# EAGLE design solar_liion (EAGLE 9.5.2)
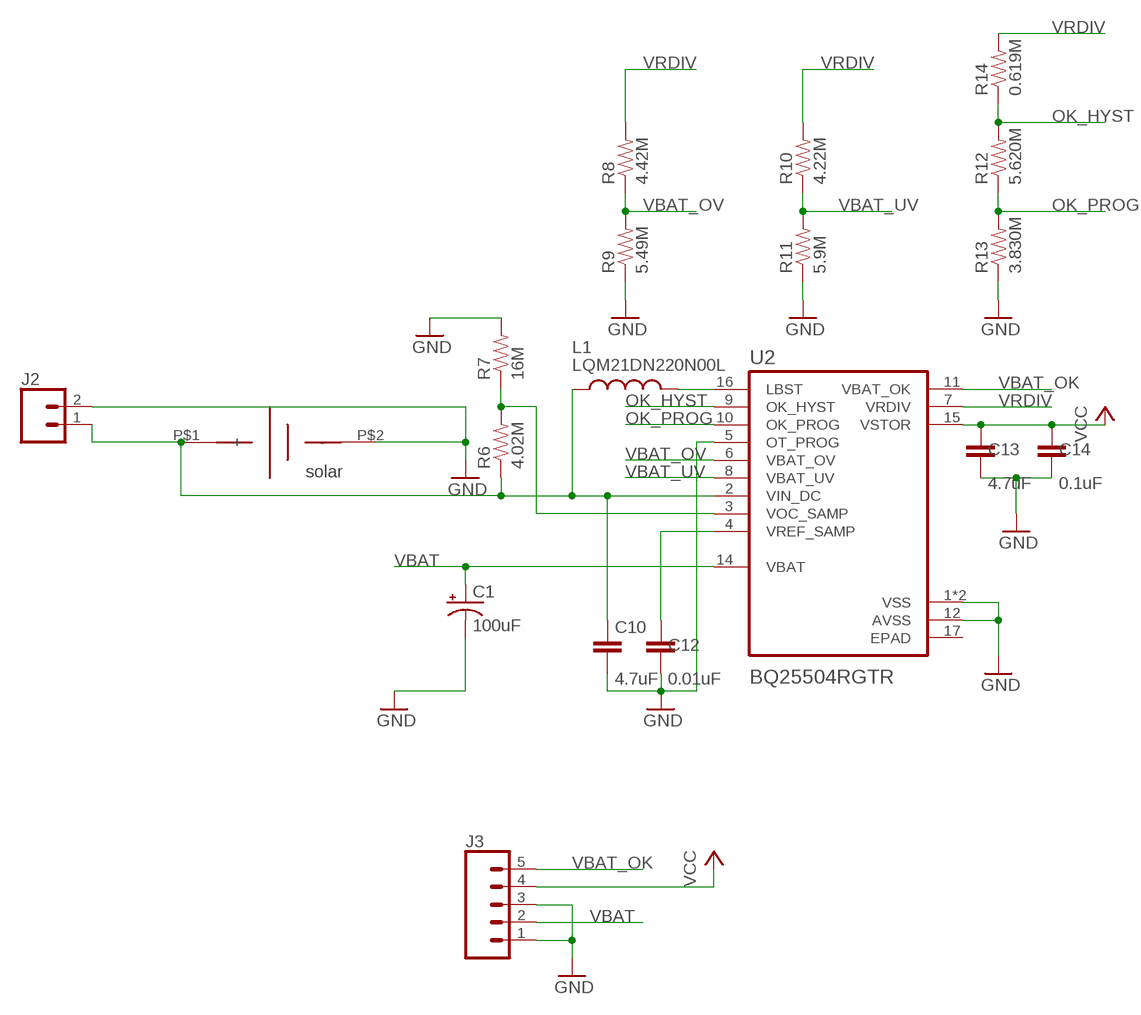
[diagram p0: schematic, sheet 1]

## Parts
C1  100uF  100UF-POLAR-EIA7343-10V-10%(TANT)  [EIA7343]
C10  4.7uF  10NF-0603-50V-10%  [0603]
C12  0.01uF  10NF-0603-50V-10%  [0603]
C13  4.7uF  10NF-0603-50V-10%  [0603]
C14  0.1uF  10NF-0603-50V-10%  [0603]
J2  CONN_02  [1X02]
J3  CONN_05  [1X05]
L1  LQM21DN220N00L  [INDC2012X145N]
R6  4.02M  470OHM-0603-1/10W-1%  [0603]
R7  16M  470OHM-0603-1/10W-1%  [0603]
R8  4.42M  470OHM-0603-1/10W-1%  [0603]
R9  5.49M  470OHM-0603-1/10W-1%  [0603]
R10  4.22M  470OHM-0603-1/10W-1%  [0603]
R11  5.9M  470OHM-0603-1/10W-1%  [0603]
R12  5.620M  470OHM-0603-1/10W-1%  [0603]
R13  3.830M  470OHM-0603-1/10W-1%  [0603]
R14  0.619M  470OHM-0603-1/10W-1%  [0603]
U2  BQ25504RGTR  [QFN50P300X300X100-17N]
U$3  KXOB25-04X3F-TR  [KXOB25-04X3F-TR]

## Nets
GND: C1.C(-) C10.2 C12.2 C13.2 C14.2 J2.2 J3.1 J3.3 R7.2 R9.1 R11.1 R13.1 U2.1(VSS) U2.5(OT_PROG) U2.12(AVSS) U2.13(VSS) U$3.P$2(-)
N$16: C10.1 J2.1 L1.1 R6.1 U2.2(VIN_DC) U$3.P$1(+)
N$17: L1.2 U2.16(LBST)
N$18: C12.1 U2.4(VREF_SAMP)
N$19: R6.2 R7.1 U2.3(VOC_SAMP)
OK_HYST: R12.2 R14.1 U2.9(OK_HYST)
OK_PROG: R12.1 R13.2 U2.10(OK_PROG)
VBAT: C1.A(+) J3.2 U2.14(VBAT)
VBAT_OK: J3.5 U2.11(VBAT_OK)
VBAT_OV: R8.1 R9.2 U2.6(VBAT_OV)
VBAT_UV: R10.1 R11.2 U2.8(VBAT_UV)
VCC: C13.1 C14.1 J3.4 U2.15(VSTOR)
VRDIV: R8.2 R10.2 R14.2 U2.7(VRDIV)

## Notes on the sheet
- solar

## Power pins joined to a net without a drawn wire
EPAD: U2.17(EPAD)

## Library data of the parts
C1 = SparkFun-Capacitors:100UF-POLAR: 100µF polarized capacitors A capacitor is a passive two-terminal electrical component used to store electrical energy temporarily in an electric field.; PROD_ID: CAP-07890
C10 C12-C14 = SparkFun-Capacitors:10NF: 0.01uF/10nF/10,000pF ceramic capacitors A capacitor is a passive two-terminal electrical component used to store electrical energy temporarily in an electric field. CAP-09321; PROD_ID: CAP-00867; VALUE: 10nF
J2 = SparkFun-Connectors:CONN_02: Multi connection point. Often used as Generic Header-pin footprint for 0.1 inch spaced/style header connections On any of the 0.1 inch spaced packages, you can populate with these: Break Away Headers - Straight <https://www.sparkfun.com/products/116> (PRT-00116) Break Away Male Headers - Right Angle <https://www.sparkfun.com/products/553> (PRT-00553) Female Headers <https://www.sparkfun.com/products/115> (PRT-00115) Break Away Headers - Machine Pin <https://www.sparkfun.com/products/117> (PRT-00117) Break Away Female Headers - Swiss Machine Pin <https://www.sparkfun.com/products/743> (PRT-00743) For SCREWTERMINALS and SPRING TERMINALS visit here: Screw Terimnals on SparkFun.com <https://www.sparkfun.com/search/results?term=Screw+Terminals> (5mm/3.5mm/2.54mm spacing) This device is also useful as a general connection point to wire up your design to another part of your project. Our various solder wires solder well into these plated through hole pads. Hook-Up Wire - Assortment (Stranded, 22 AWG) <https://www.sparkfun.com/products/11375> (PRT-11375) Hook-Up Wire - Assortment (Solid Core, 22 AWG) <https://www.sparkfun.com/products/11367> (PRT-11367) View the entire wire category on our website here <https://www.sparkfun.com/categories/141> Special notes: Molex polarized connector foot print use with: PRT-08233 with associated crimp pins and housings. 2.54_SCREWTERM for use with PRT-10571. 3.5mm Screw Terminal footprints for PRT-08084 5mm Screw Terminal footprints for use with PRT-08432
J3 = SparkFun-Connectors:CONN_05: Multi connection point. Often used as Generic Header-pin footprint for 0.1 inch spaced/style header connections On any of the 0.1 inch spaced packages, you can populate with these: Break Away Headers - Straight <https://www.sparkfun.com/products/116> (PRT-00116) Break Away Male Headers - Right Angle <https://www.sparkfun.com/products/553> (PRT-00553) Female Headers <https://www.sparkfun.com/products/115> (PRT-00115) Break Away Headers - Machine Pin <https://www.sparkfun.com/products/117> (PRT-00117) Break Away Female Headers - Swiss Machine Pin <https://www.sparkfun.com/products/743> (PRT-00743) For SCREWTERMINALS and SPRING TERMINALS visit here: Screw Terimnals on SparkFun.com <https://www.sparkfun.com/search/results?term=Screw+Terminals> (5mm/3.5mm/2.54mm spacing) This device is also useful as a general connection point to wire up your design to another part of your project. Our various solder wires solder well into these plated through hole pads. Hook-Up Wire - Assortment (Stranded, 22 AWG) <https://www.sparkfun.com/products/11375> (PRT-11375) Hook-Up Wire - Assortment (Solid Core, 22 AWG) <https://www.sparkfun.com/products/11367> (PRT-11367) View the entire wire category on our website here <https://www.sparkfun.com/categories/141> Special notes: Molex polarized connector foot print use with SKU : PRT-08231 with associated crimp pins and housings. 1MM SMD Version SKU: PRT-10208
L1 = LQM21DN220N00L:LQM21DN220N00L: LQM Series 0805 22 uH ±30 % Tol. 13 mA SMT High Frequency Multilayer Inductor; AVAILABILITY: Unavailable; DESCRIPTION: Inductor with Inductance: 22uH Tol. +/-30%, Package: 0805 (2012); MF: Murata; MP: LQM21DN220N00L; PACKAGE: 2012 Bourns; PRICE: None
R6-R14 = SparkFun-Resistors:470OHM: 470Ω resistor A resistor is a passive two-terminal electrical component that implements electrical resistance as a circuit element. Resistors act to reduce current flow, and, at the same time, act to lower voltage levels within circuits. - Wikipedia; PROD_ID: RES-07869; VALUE: 470
U2 = BQ25504RGTR:BQ25504RGTR: Check prices <https://pricing.snapeda.com/parts/BQ25504RGTR/Texas%20Instruments/view-part?ref=eda>; AVAILABILITY: Good; DESCRIPTION: Ultra Low Power Boost Converter with Battery Management for Energy Harvester | Nano-Power Management 16-VQFN -40 to 85; MF: Texas Instruments; MP: BQ25504RGTR; PACKAGE: VQFN-16 Texas Instruments; PRICE: None; PURCHASE-URL: https://pricing.snapeda.com/search/part/BQ25504RGTR/?ref=eda
U$3 = KXOB25-04X3F-TR :KXOB25-04X3F-TR

## Board
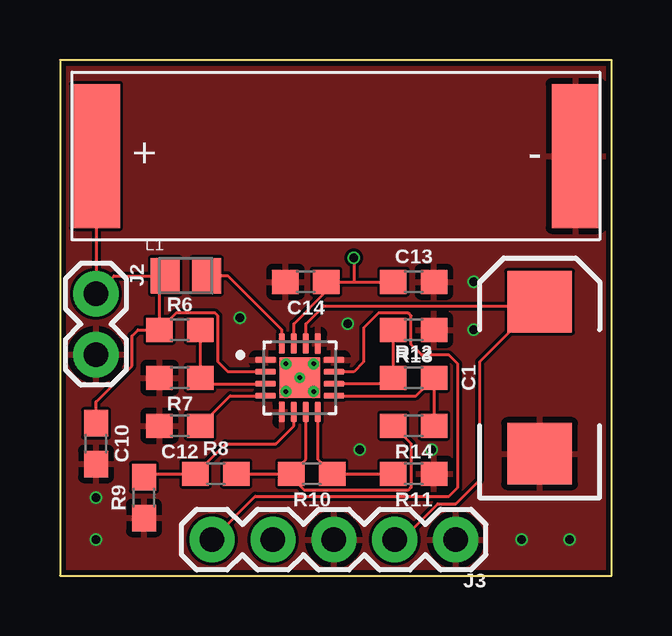
[diagram p1: board, top side]
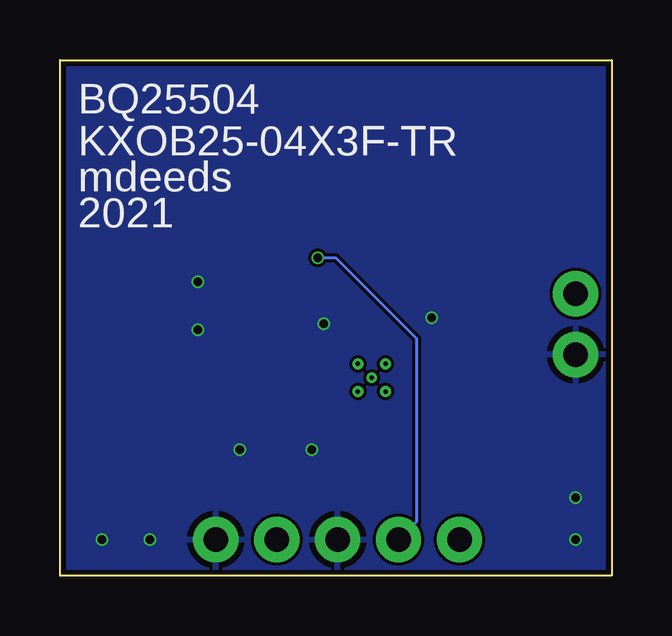
[diagram p2: board, bottom side, seen from below]

Size 23 x 21.5 mm. Coordinates in mm from the lower left corner, seen from the top.
Outline: 0,0 23,0 23,21.5 0,21.5 0,0
Copper layers (1*16): Top 0.035559375mm / dielectric 1.6mm / Bottom 0.035559375mm
Design rules "jlcpcb2layer": minimum track width 5mil, minimum drill 12mil, track to track 5mil, track to pad 5mil, pad to pad 5mil, via to via 5mil, smd to smd 5mil, copper to edge 8mil, drill to drill 6mil, minimum pad ring 5mil, minimum via ring 3mil, stop-mask expansion 2.5mil, vias tented up to drill 0mil, thermal gap 10mil

### Footprints (pad centres in the part's own frame; a part is rotated, then mirrored left to right if it is on the bottom)
EIA7343 = smd 2.55 x 2.7: A 3.17,0; C -3.17,0
0603 = smd 1.1 x 1: 1 -0.85,0; 2 0.85,0
1X02 = drill 1.016 pad 1.88: 1 0,0; 2 2.54,0
1X05 = drill 1.016 pad 1.88: 1 0,0; 2 2.54,0; 3 5.08,0; 4 7.62,0; 5 10.16,0
INDC2012X145N = smd 1.2 x 1.47: 1 -0.86,0; 2 0.86,0
QFN50P300X300X100-17N = smd 0.86 x 0.26: 1 -1.435,0.75; 2 -1.435,0.25; 3 -1.435,-0.25; 4 -1.435,-0.75; 9 1.435,-0.75; 10 1.435,-0.25; 11 1.435,0.25; 12 1.435,0.75 | smd 0.26 x 0.86: 5 -0.75,-1.435; 6 -0.25,-1.435; 7 0.25,-1.435; 8 0.75,-1.435; 13 0.75,1.435; 14 0.25,1.435; 15 -0.25,1.435; 16 -0.75,1.435 | smd 1.68 x 1.68: 17 0,0 | drill 0.2 pad 0.4: 18 0,0; 19 -0.58,0.58; 20 0.58,0.58; 21 -0.58,-0.58; 22 0.58,-0.58
KXOB25-04X3F-TR = smd 2 x 6: P$1 0,0; P$2 20,0

### Placement (x,y rotation side)
C1  20,8.25 90 top
C10  1.5,5.5 270 top
C12  5,6.25 180 top
C13  14.75,12.25 0 top
C14  10.25,12.25 180 top
J2  1.5,11.75 270 top
J3  16.5,1.5 180 top
L1  5.25,12.5 0 top
R6  5,10.25 0 top
R7  5,8.25 180 top
R8  6.5,4.25 0 top
R9  3.5,3.25 90 top
R10  10.5,4.25 180 top
R11  14.75,4.25 180 top
R12  14.75,8.25 0 top
R13  14.75,10.25 180 top
R14  14.75,6.25 180 top
U2  10,8.25 0 top
U$3  1.5,17.5 0 top

### Tracks (layer width: path | path; a pad name or v marks a point on that pad's centre or on a via)
GND  (via drill 0.35)
  other vias: 7.5,10.75 12,10.5 19.25,1.5 21.25,1.5 1.5,1.5 1.5,3.25 15.5,5.25 12.5,5.25 17.25,10.25 17.25,12.25
  pour Top: -0.75,22.25 23.75,22.25 23.75,-1.25 -0.75,-1.25
  pour Bottom: -0.5,22 23.5,22 23.5,-1 -0.5,-1
N$16
  Top 0.127: 4.25,12.5 2.25,12.5 J2.1 U$3.P$1 | 4.25,12.5 L1.1 | R6.1 4.15,12.4 4.25,12.5 | C10.1 1.5,7.25 3,8.75 3,10 3.25,10.25 R6.1 | U2.2 7,8.5 6.59,8.91 6.59,10.83 6.48,10.94 4.84,10.94 R6.1
N$17
  Top 0.127: U2.16 9.25,10.25 7,12.5 L1.2
N$18
  Top 0.127: C12.1 7.1,7.5 U2.4
N$19
  Top 0.127: R6.2 R7.1 6.1,8 U2.3
OK_HYST
  Top 0.127: R14.1 R12.2 14.85,7.5 U2.9
OK_PROG
  Top 0.127: U2.10 13.65,8 R12.1 R13.2
VBAT
  Top 0.127: J3.2 14.25,1.5 15.75,3 16.5,3 17.5,4 17.5,8.92 19.83,11.25 | C1.A 19.91,11.34 19.83,11.25 | U2.14 10.25,10.5 11,11.25 19.83,11.25
VBAT_OK
  Top 0.127: J3.5 8.15,3.31 16.23,3.31 16.59,3.67 16.59,8.83 16.23,9.19 15.09,9.19 14.64,9.64 14.64,10.83 14.53,10.94 13.27,10.94 12.66,10.33 12.66,8.91 12.25,8.5 U2.11
VBAT_OV
  Top 0.127: R9.2 3.65,4.25 R8.1 6.9,5.5 9,5.5 9.75,6.25 U2.6
VBAT_UV
  Top 0.127: R11.2 R10.1 10.75,4.85 U2.8
VCC  (via drill 0.35)
  Top 0.127: 12.25,12.25 C14.1 11.1,11.85 9.75,10.5 U2.15 | 12.25,12.25 C13.1 | v12.25,13.25 12.25,12.25
  Bottom 0.127: J3.4 8.13,2.25 8.13,9.88 11.5,13.25 v12.25,13.25
VRDIV
  Top 0.127: R8.2 9.5,4.25 | 9.5,4.25 R10.2 10.25,4.85 U2.7 | R14.2 14.64,5.51 14.64,3.67 14.53,3.56 10.19,3.56 9.5,4.25

### Text on the board
bPlace: BQ25504 | KXOB25-04X3F-TR | mdeeds | 2021